# EAGLE design untitled (EAGLE 9.1.3)

## Sheet 1 of 2
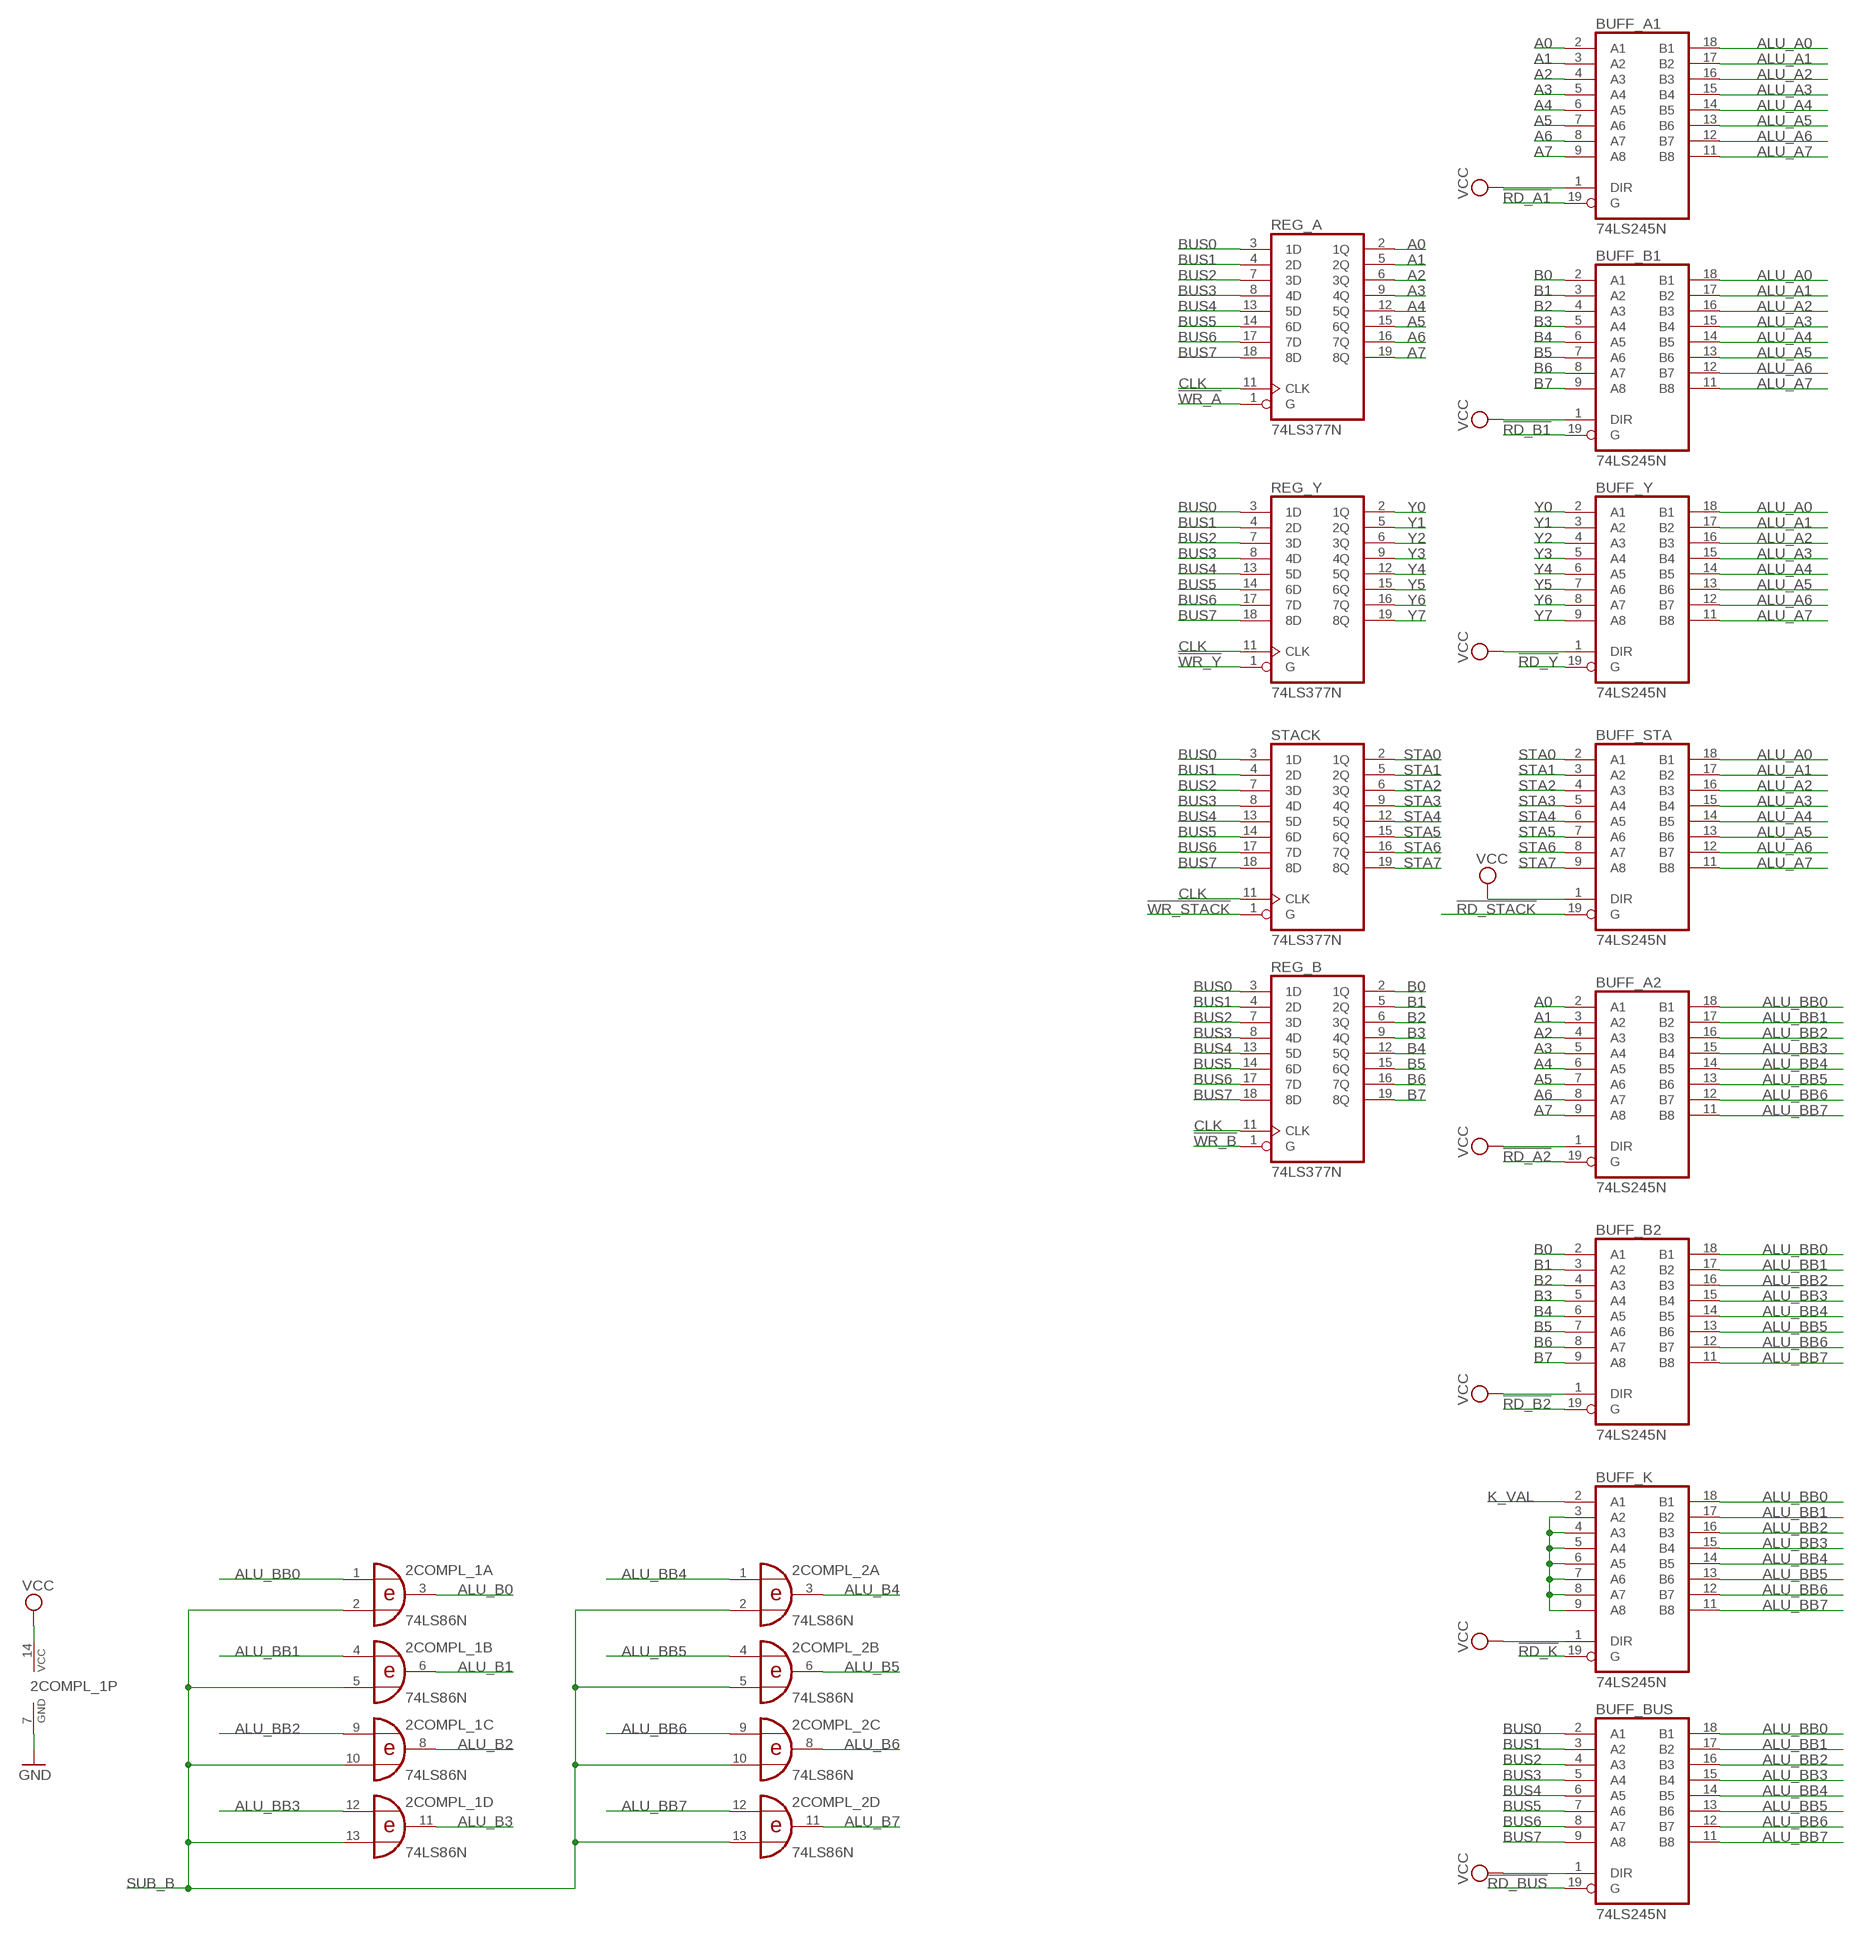
[diagram p0: schematic, sheet 1, part 1 of 2]
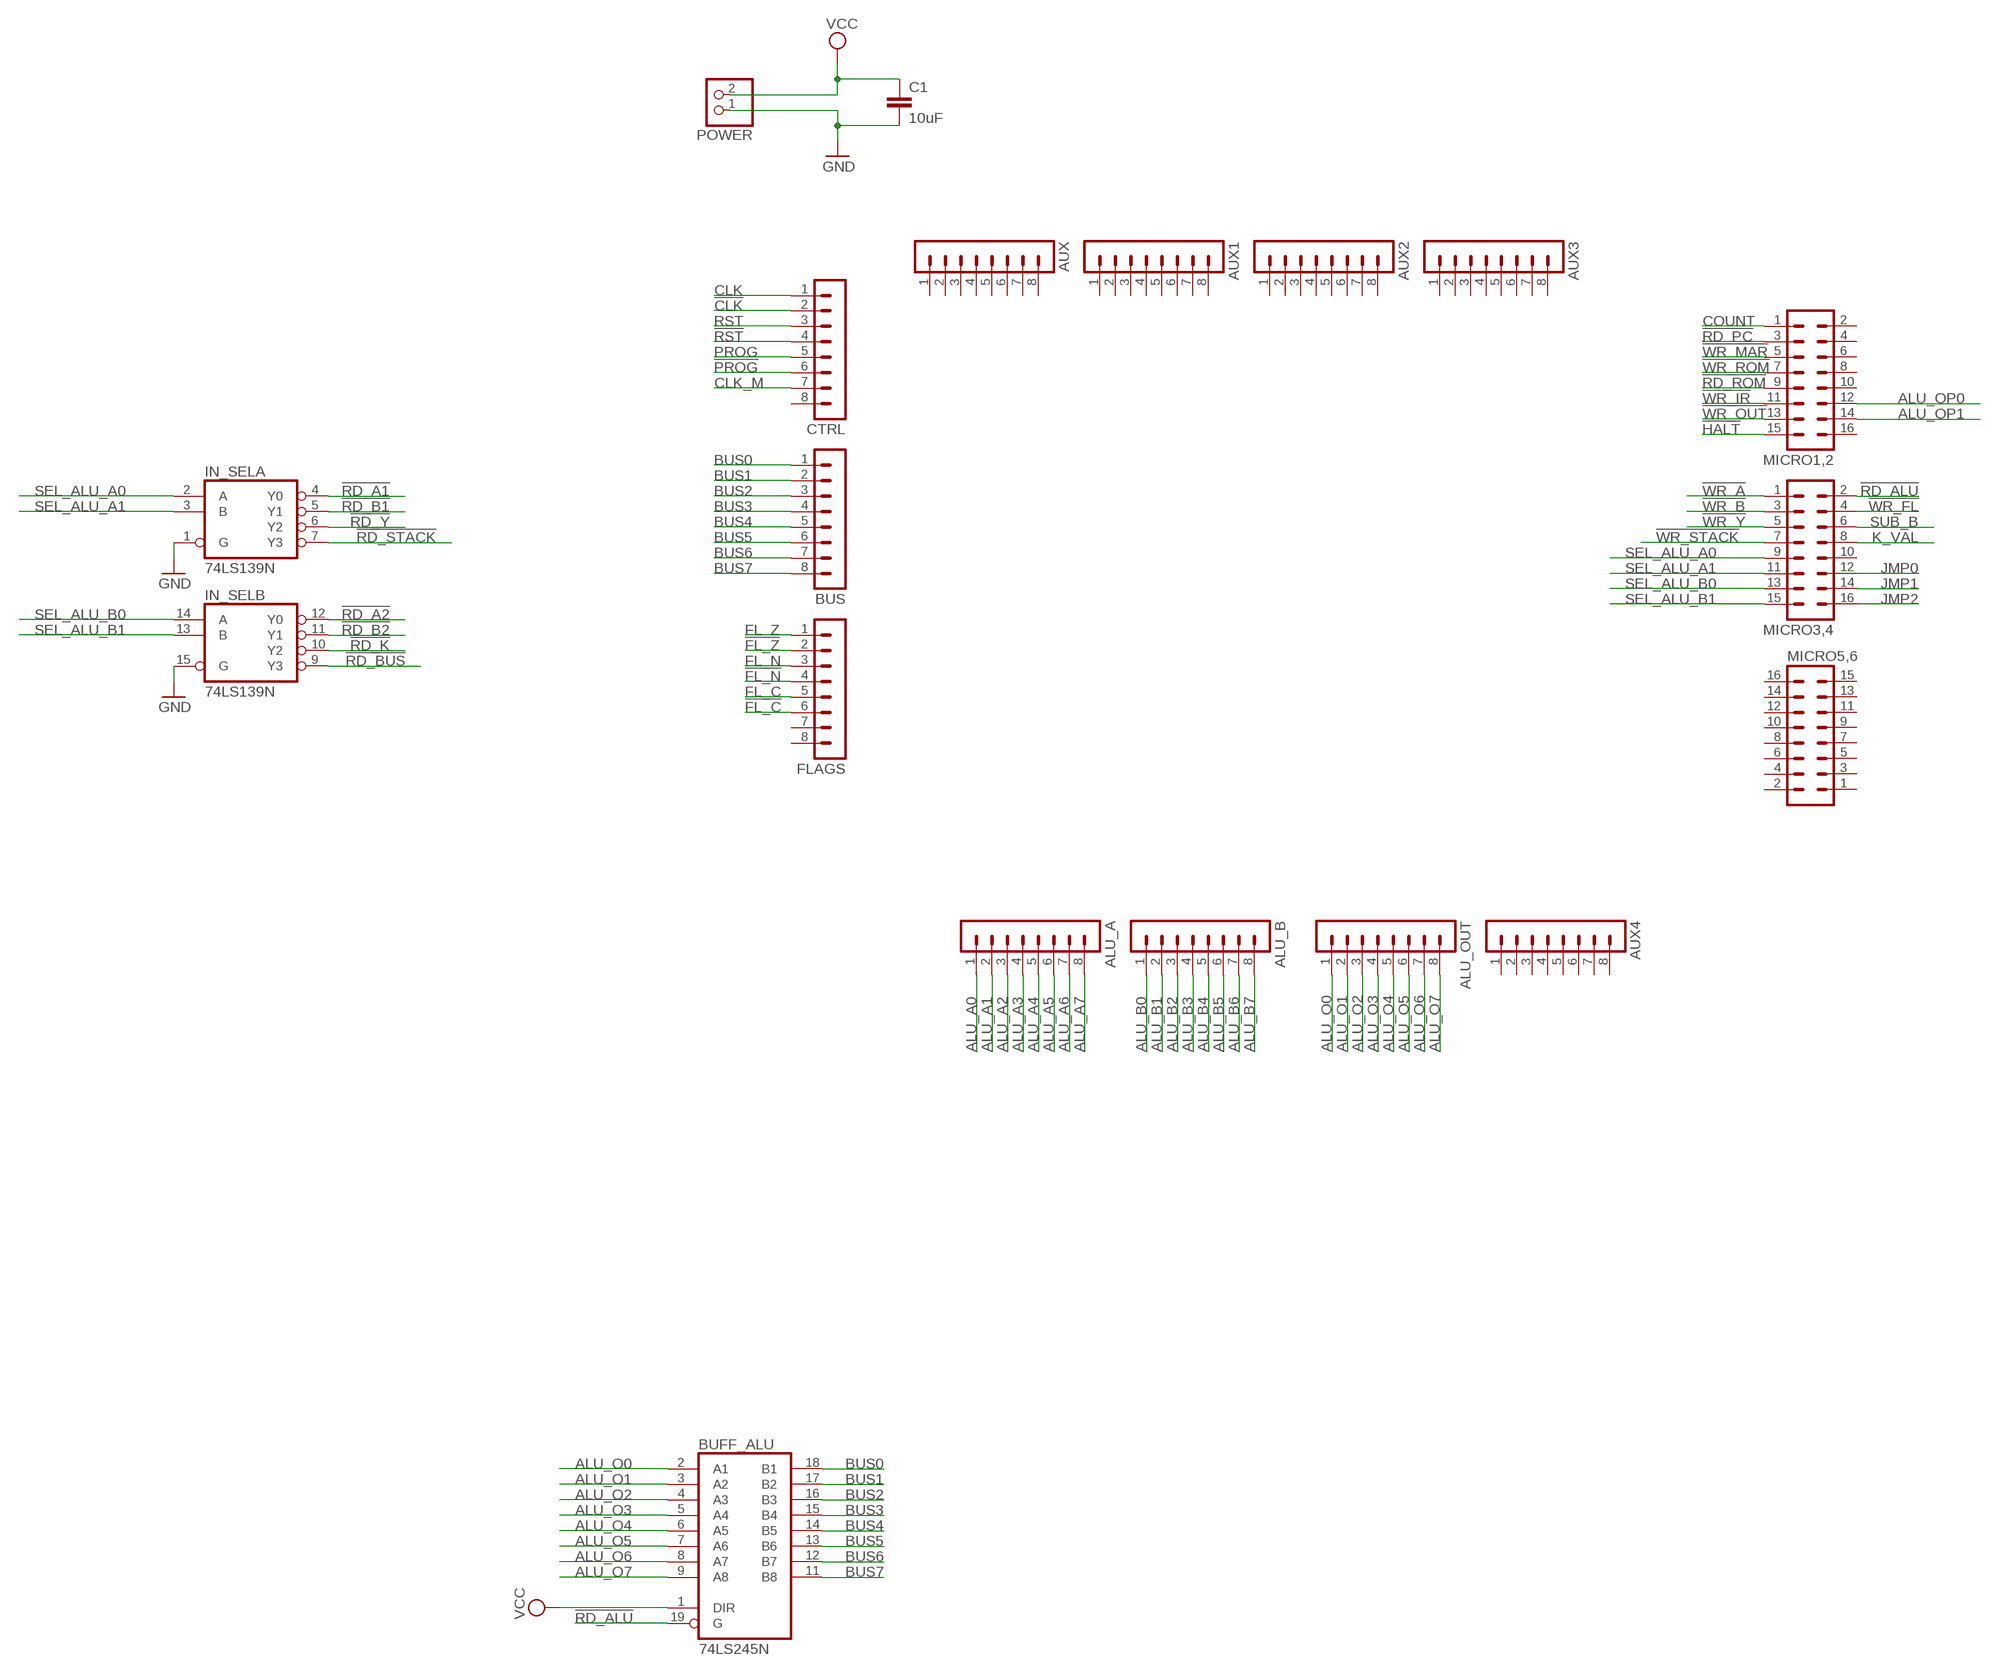
[diagram p1: schematic, sheet 1, part 2 of 2]

### Parts
2COMPL_1  74LS86N  [DIL14]
2COMPL_2  74LS86N  [DIL14]
ALU_A  MA08-1  [MA08-1]
ALU_B  MA08-1  [MA08-1]
ALU_OUT  MA08-1  [MA08-1]
AUX  MA08-1  [MA08-1]
AUX1  MA08-1  [MA08-1]
AUX2  MA08-1  [MA08-1]
AUX3  MA08-1  [MA08-1]
AUX4  MA08-1  [MA08-1]
BUFF_A1  74LS245N  [DIL20]
BUFF_A2  74LS245N  [DIL20]
BUFF_ALU  74LS245N  [DIL20]
BUFF_B1  74LS245N  [DIL20]
BUFF_B2  74LS245N  [DIL20]
BUFF_BUS  74LS245N  [DIL20]
BUFF_K  74LS245N  [DIL20]
BUFF_STA  74LS245N  [DIL20]
BUFF_Y  74LS245N  [DIL20]
BUS  MA08-1  [MA08-1]
C1  10uF  C-EU025-050X050  [C025-050X050]
CTRL  MA08-1  [MA08-1]
FLAGS  MA08-1  [MA08-1]
IN_SEL  74LS139N  [DIL16]
MICRO1,2  MA08-2  [MA08-2]
MICRO3,4  MA08-2  [MA08-2]
MICRO5,6  MA08-2  [MA08-2]
POWER  PINHD-1X2  [1X02]
REG_A  74LS377N  [DIL20]
REG_B  74LS377N  [DIL20]
REG_Y  74LS377N  [DIL20]
STACK  74LS377N  [DIL20]

### Nets
!CLK: CTRL.2
!FL_C: FLAGS.6
!FL_N: FLAGS.4
!FL_Z: FLAGS.2
!HALT: MICRO1,2.15
!PROG: CTRL.6
!RD_A1: BUFF_A1.19(G) IN_SEL.4(A:Y0)
!RD_A2: BUFF_A2.19(G) IN_SEL.12(B:Y0)
!RD_ALU: BUFF_ALU.19(G) MICRO3,4.2
!RD_B1: BUFF_B1.19(G) IN_SEL.5(A:Y1)
!RD_B2: BUFF_B2.19(G) IN_SEL.11(B:Y1)
!RD_BUS: BUFF_BUS.19(G) IN_SEL.9(B:Y3)
!RD_K: BUFF_K.19(G) IN_SEL.10(B:Y2)
!RD_PC: MICRO1,2.3
!RD_ROM: MICRO1,2.9
!RD_STACK: BUFF_STA.19(G) IN_SEL.7(A:Y3)
!RD_Y: BUFF_Y.19(G) IN_SEL.6(A:Y2)
!RST: CTRL.4
!WR_A: MICRO3,4.1 REG_A.1(G)
!WR_B: MICRO3,4.3 REG_B.1(G)
!WR_FL: MICRO3,4.4
!WR_IR: MICRO1,2.11
!WR_MAR: MICRO1,2.5
!WR_OUT: MICRO1,2.13
!WR_ROM: MICRO1,2.7
!WR_STACK: MICRO3,4.7 STACK.1(G)
!WR_Y: MICRO3,4.5 REG_Y.1(G)
A0: BUFF_A1.2(A1) BUFF_A2.2(A1) REG_A.2(1Q)
A1: BUFF_A1.3(A2) BUFF_A2.3(A2) REG_A.5(2Q)
A2: BUFF_A1.4(A3) BUFF_A2.4(A3) REG_A.6(3Q)
A3: BUFF_A1.5(A4) BUFF_A2.5(A4) REG_A.9(4Q)
A4: BUFF_A1.6(A5) BUFF_A2.6(A5) REG_A.12(5Q)
A5: BUFF_A1.7(A6) BUFF_A2.7(A6) REG_A.15(6Q)
A6: BUFF_A1.8(A7) BUFF_A2.8(A7) REG_A.16(7Q)
A7: BUFF_A1.9(A8) BUFF_A2.9(A8) REG_A.19(8Q)
ALU_A0: ALU_A.1 BUFF_A1.18(B1) BUFF_B1.18(B1) BUFF_STA.18(B1) BUFF_Y.18(B1)
ALU_A1: ALU_A.2 BUFF_A1.17(B2) BUFF_B1.17(B2) BUFF_STA.17(B2) BUFF_Y.17(B2)
ALU_A2: ALU_A.3 BUFF_A1.16(B3) BUFF_B1.16(B3) BUFF_STA.16(B3) BUFF_Y.16(B3)
ALU_A3: ALU_A.4 BUFF_A1.15(B4) BUFF_B1.15(B4) BUFF_STA.15(B4) BUFF_Y.15(B4)
ALU_A4: ALU_A.5 BUFF_A1.14(B5) BUFF_B1.14(B5) BUFF_STA.14(B5) BUFF_Y.14(B5)
ALU_A5: ALU_A.6 BUFF_A1.13(B6) BUFF_B1.13(B6) BUFF_STA.13(B6) BUFF_Y.13(B6)
ALU_A6: ALU_A.7 BUFF_A1.12(B7) BUFF_B1.12(B7) BUFF_STA.12(B7) BUFF_Y.12(B7)
ALU_A7: ALU_A.8 BUFF_A1.11(B8) BUFF_B1.11(B8) BUFF_STA.11(B8) BUFF_Y.11(B8)
ALU_B0: 2COMPL_1.3(A:O) ALU_B.1
ALU_B1: 2COMPL_1.6(B:O) ALU_B.2
ALU_B2: 2COMPL_1.8(C:O) ALU_B.3
ALU_B3: 2COMPL_1.11(D:O) ALU_B.4
ALU_B4: 2COMPL_2.3(A:O) ALU_B.5
ALU_B5: 2COMPL_2.6(B:O) ALU_B.6
ALU_B6: 2COMPL_2.8(C:O) ALU_B.7
ALU_B7: 2COMPL_2.11(D:O) ALU_B.8
ALU_BB0: 2COMPL_1.1(A:I0) BUFF_A2.18(B1) BUFF_B2.18(B1) BUFF_BUS.18(B1) BUFF_K.18(B1)
ALU_BB1: 2COMPL_1.4(B:I0) BUFF_A2.17(B2) BUFF_B2.17(B2) BUFF_BUS.17(B2) BUFF_K.17(B2)
ALU_BB2: 2COMPL_1.9(C:I0) BUFF_A2.16(B3) BUFF_B2.16(B3) BUFF_BUS.16(B3) BUFF_K.16(B3)
ALU_BB3: 2COMPL_1.12(D:I0) BUFF_A2.15(B4) BUFF_B2.15(B4) BUFF_BUS.15(B4) BUFF_K.15(B4)
ALU_BB4: 2COMPL_2.1(A:I0) BUFF_A2.14(B5) BUFF_B2.14(B5) BUFF_BUS.14(B5) BUFF_K.14(B5)
ALU_BB5: 2COMPL_2.4(B:I0) BUFF_A2.13(B6) BUFF_B2.13(B6) BUFF_BUS.13(B6) BUFF_K.13(B6)
ALU_BB6: 2COMPL_2.9(C:I0) BUFF_A2.12(B7) BUFF_B2.12(B7) BUFF_BUS.12(B7) BUFF_K.12(B7)
ALU_BB7: 2COMPL_2.12(D:I0) BUFF_A2.11(B8) BUFF_B2.11(B8) BUFF_BUS.11(B8) BUFF_K.11(B8)
ALU_O0: ALU_OUT.1 BUFF_ALU.2(A1)
ALU_O1: ALU_OUT.2 BUFF_ALU.3(A2)
ALU_O2: ALU_OUT.3 BUFF_ALU.4(A3)
ALU_O3: ALU_OUT.4 BUFF_ALU.5(A4)
ALU_O4: ALU_OUT.5 BUFF_ALU.6(A5)
ALU_O5: ALU_OUT.6 BUFF_ALU.7(A6)
ALU_O6: ALU_OUT.7 BUFF_ALU.8(A7)
ALU_O7: ALU_OUT.8 BUFF_ALU.9(A8)
ALU_OP0: MICRO1,2.12
ALU_OP1: MICRO1,2.14
B0: BUFF_B1.2(A1) BUFF_B2.2(A1) REG_B.2(1Q)
B1: BUFF_B1.3(A2) BUFF_B2.3(A2) REG_B.5(2Q)
B2: BUFF_B1.4(A3) BUFF_B2.4(A3) REG_B.6(3Q)
B3: BUFF_B1.5(A4) BUFF_B2.5(A4) REG_B.9(4Q)
B4: BUFF_B1.6(A5) BUFF_B2.6(A5) REG_B.12(5Q)
B5: BUFF_B1.7(A6) BUFF_B2.7(A6) REG_B.15(6Q)
B6: BUFF_B1.8(A7) BUFF_B2.8(A7) REG_B.16(7Q)
B7: BUFF_B1.9(A8) BUFF_B2.9(A8) REG_B.19(8Q)
BUS0: BUFF_ALU.18(B1) BUFF_BUS.2(A1) BUS.1 REG_A.3(1D) REG_B.3(1D) REG_Y.3(1D) STACK.3(1D)
BUS1: BUFF_ALU.17(B2) BUFF_BUS.3(A2) BUS.2 REG_A.4(2D) REG_B.4(2D) REG_Y.4(2D) STACK.4(2D)
BUS2: BUFF_ALU.16(B3) BUFF_BUS.4(A3) BUS.3 REG_A.7(3D) REG_B.7(3D) REG_Y.7(3D) STACK.7(3D)
BUS3: BUFF_ALU.15(B4) BUFF_BUS.5(A4) BUS.4 REG_A.8(4D) REG_B.8(4D) REG_Y.8(4D) STACK.8(4D)
BUS4: BUFF_ALU.14(B5) BUFF_BUS.6(A5) BUS.5 REG_A.13(5D) REG_B.13(5D) REG_Y.13(5D) STACK.13(5D)
BUS5: BUFF_ALU.13(B6) BUFF_BUS.7(A6) BUS.6 REG_A.14(6D) REG_B.14(6D) REG_Y.14(6D) STACK.14(6D)
BUS6: BUFF_ALU.12(B7) BUFF_BUS.8(A7) BUS.7 REG_A.17(7D) REG_B.17(7D) REG_Y.17(7D) STACK.17(7D)
BUS7: BUFF_ALU.11(B8) BUFF_BUS.9(A8) BUS.8 REG_A.18(8D) REG_B.18(8D) REG_Y.18(8D) STACK.18(8D)
CLK: CTRL.1 REG_A.11(CLK) REG_B.11(CLK) REG_Y.11(CLK) STACK.11(CLK)
CLK_M: CTRL.7
COUNT: MICRO1,2.1
FL_C: FLAGS.5
FL_N: FLAGS.3
FL_Z: FLAGS.1
GND: 2COMPL_1.7(P:GND) C1.2 IN_SEL.1(A:G) IN_SEL.15(B:G) POWER.1
JMP0: MICRO3,4.12
JMP1: MICRO3,4.14
JMP2: MICRO3,4.16
K_VAL: BUFF_K.2(A1) MICRO3,4.8
N$1: BUFF_K.3(A2) BUFF_K.4(A3) BUFF_K.5(A4) BUFF_K.6(A5) BUFF_K.7(A6) BUFF_K.8(A7) BUFF_K.9(A8)
PROG: CTRL.5
RST: CTRL.3
SEL_ALU_A0: IN_SEL.2(A:A) MICRO3,4.9
SEL_ALU_A1: IN_SEL.3(A:B) MICRO3,4.11
SEL_ALU_B0: IN_SEL.14(B:A) MICRO3,4.13
SEL_ALU_B1: IN_SEL.13(B:B) MICRO3,4.15
STA0: BUFF_STA.2(A1) STACK.2(1Q)
STA1: BUFF_STA.3(A2) STACK.5(2Q)
STA2: BUFF_STA.4(A3) STACK.6(3Q)
STA3: BUFF_STA.5(A4) STACK.9(4Q)
STA4: BUFF_STA.6(A5) STACK.12(5Q)
STA5: BUFF_STA.7(A6) STACK.15(6Q)
STA6: BUFF_STA.8(A7) STACK.16(7Q)
STA7: BUFF_STA.9(A8) STACK.19(8Q)
SUB_B: 2COMPL_1.2(A:I1) 2COMPL_1.5(B:I1) 2COMPL_1.10(C:I1) 2COMPL_1.13(D:I1) 2COMPL_2.2(A:I1) 2COMPL_2.5(B:I1) 2COMPL_2.10(C:I1) 2COMPL_2.13(D:I1) MICRO3,4.6
VCC: 2COMPL_1.14(P:VCC) BUFF_A1.1(DIR) BUFF_A2.1(DIR) BUFF_ALU.1(DIR) BUFF_B1.1(DIR) BUFF_B2.1(DIR) BUFF_BUS.1(DIR) BUFF_K.1(DIR) BUFF_STA.1(DIR) BUFF_Y.1(DIR) C1.1 POWER.2
Y0: BUFF_Y.2(A1) REG_Y.2(1Q)
Y1: BUFF_Y.3(A2) REG_Y.5(2Q)
Y2: BUFF_Y.4(A3) REG_Y.6(3Q)
Y3: BUFF_Y.5(A4) REG_Y.9(4Q)
Y4: BUFF_Y.6(A5) REG_Y.12(5Q)
Y5: BUFF_Y.7(A6) REG_Y.15(6Q)
Y6: BUFF_Y.8(A7) REG_Y.16(7Q)
Y7: BUFF_Y.9(A8) REG_Y.19(8Q)
Unconnected: AUX1.1 AUX1.2 AUX1.3 AUX1.4 AUX1.5 AUX1.6 AUX1.7 AUX1.8 AUX2.1 AUX2.2 AUX2.3 AUX2.4 AUX2.5 AUX2.6 AUX2.7 AUX2.8 AUX3.1 AUX3.2 AUX3.3 AUX3.4 AUX3.5 AUX3.6 AUX3.7 AUX3.8 AUX4.1 AUX4.2 AUX4.3 AUX4.4 AUX4.5 AUX4.6 AUX4.7 AUX4.8 AUX.1 AUX.2 AUX.3 AUX.4 AUX.5 AUX.6 AUX.7 AUX.8 CTRL.8 FLAGS.7 FLAGS.8 MICRO1,2.2 MICRO1,2.4 MICRO1,2.6 MICRO1,2.8 MICRO1,2.10 MICRO1,2.16 MICRO3,4.10 MICRO5,6.1 MICRO5,6.2 MICRO5,6.3 MICRO5,6.4 MICRO5,6.5 MICRO5,6.6 MICRO5,6.7 MICRO5,6.8 MICRO5,6.9 MICRO5,6.10 MICRO5,6.11 MICRO5,6.12 MICRO5,6.13 MICRO5,6.14 MICRO5,6.15 MICRO5,6.16

## Sheet 2 of 2

## Power pins joined to a net without a drawn wire
GND: 2COMPL_2.7(P:GND) BUFF_A1.10(GND) BUFF_A2.10(GND) BUFF_ALU.10(GND) BUFF_B1.10(GND) BUFF_B2.10(GND) BUFF_BUS.10(GND) BUFF_K.10(GND) BUFF_STA.10(GND) BUFF_Y.10(GND) IN_SEL.8(P:GND) REG_A.10(GND) REG_B.10(GND) REG_Y.10(GND) STACK.10(GND)
VCC: 2COMPL_2.14(P:VCC) BUFF_A1.20(VCC) BUFF_A2.20(VCC) BUFF_ALU.20(VCC) BUFF_B1.20(VCC) BUFF_B2.20(VCC) BUFF_BUS.20(VCC) BUFF_K.20(VCC) BUFF_STA.20(VCC) BUFF_Y.20(VCC) IN_SEL.16(P:VCC) REG_A.20(VCC) REG_B.20(VCC) REG_Y.20(VCC) STACK.20(VCC)

## Library data of the parts
2COMPL_1 2COMPL_2 = 74xx-eu:74*86: Quad 2-input EXCLUSIVE-OR (XOR) gate
ALU_A ALU_B ALU_OUT AUX AUX1-AUX4 BUS CTRL FLAGS = con-lstb:MA08-1: PIN HEADER; OC_FARNELL: unknown; OC_NEWARK: unknown
BUFF_A1 BUFF_A2 BUFF_ALU BUFF_B1 BUFF_B2 BUFF_BUS BUFF_K BUFF_STA BUFF_Y = 74xx-eu:74*245: Octal BUS TRANSCEIVER, 3-state
C1 = rcl:C-EU: CAPACITOR, European symbol; SPICEPREFIX: C
IN_SEL = 74xx-eu:74*139: Dual 2-line to 4-line DECODER/DEMULTIPLEXER
MICRO1,2 MICRO3,4 MICRO5,6 = con-lstb:MA08-2: PIN HEADER; OC_FARNELL: unknown; OC_NEWARK: unknown
POWER = pinhead:PINHD-1X2: PIN HEADER
REG_A REG_B REG_Y STACK = 74xx-eu:74*377: Octal D type FLIP FLOP, enable

## Board
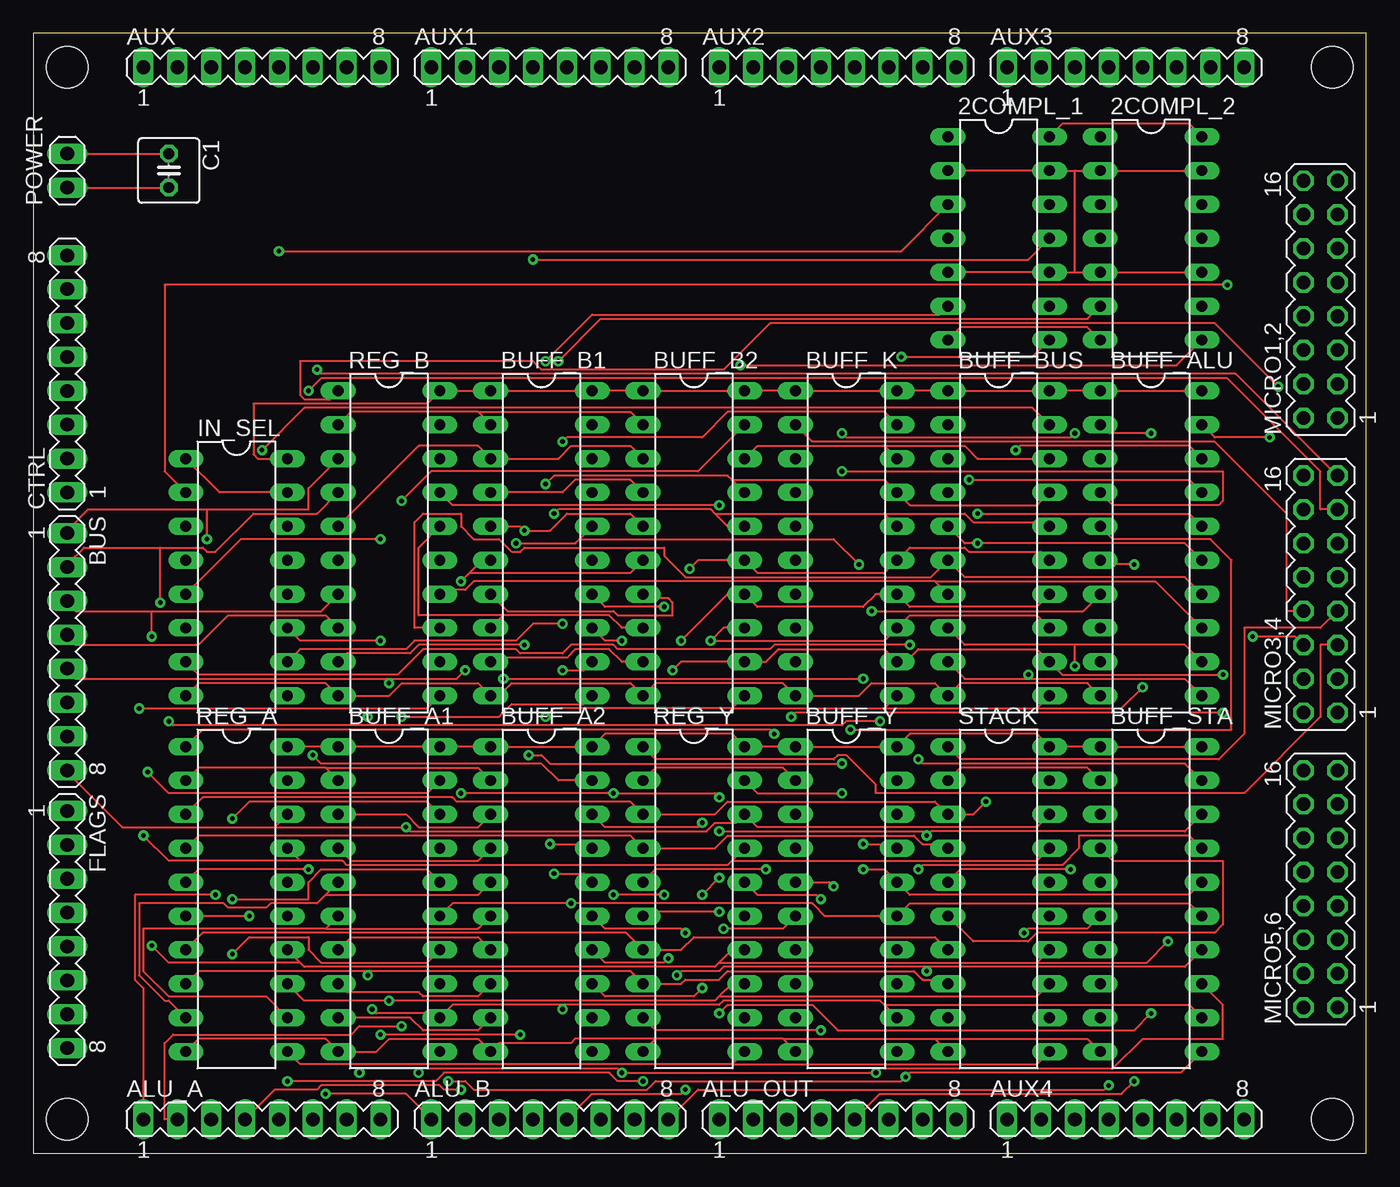
[diagram p2: board, top side]
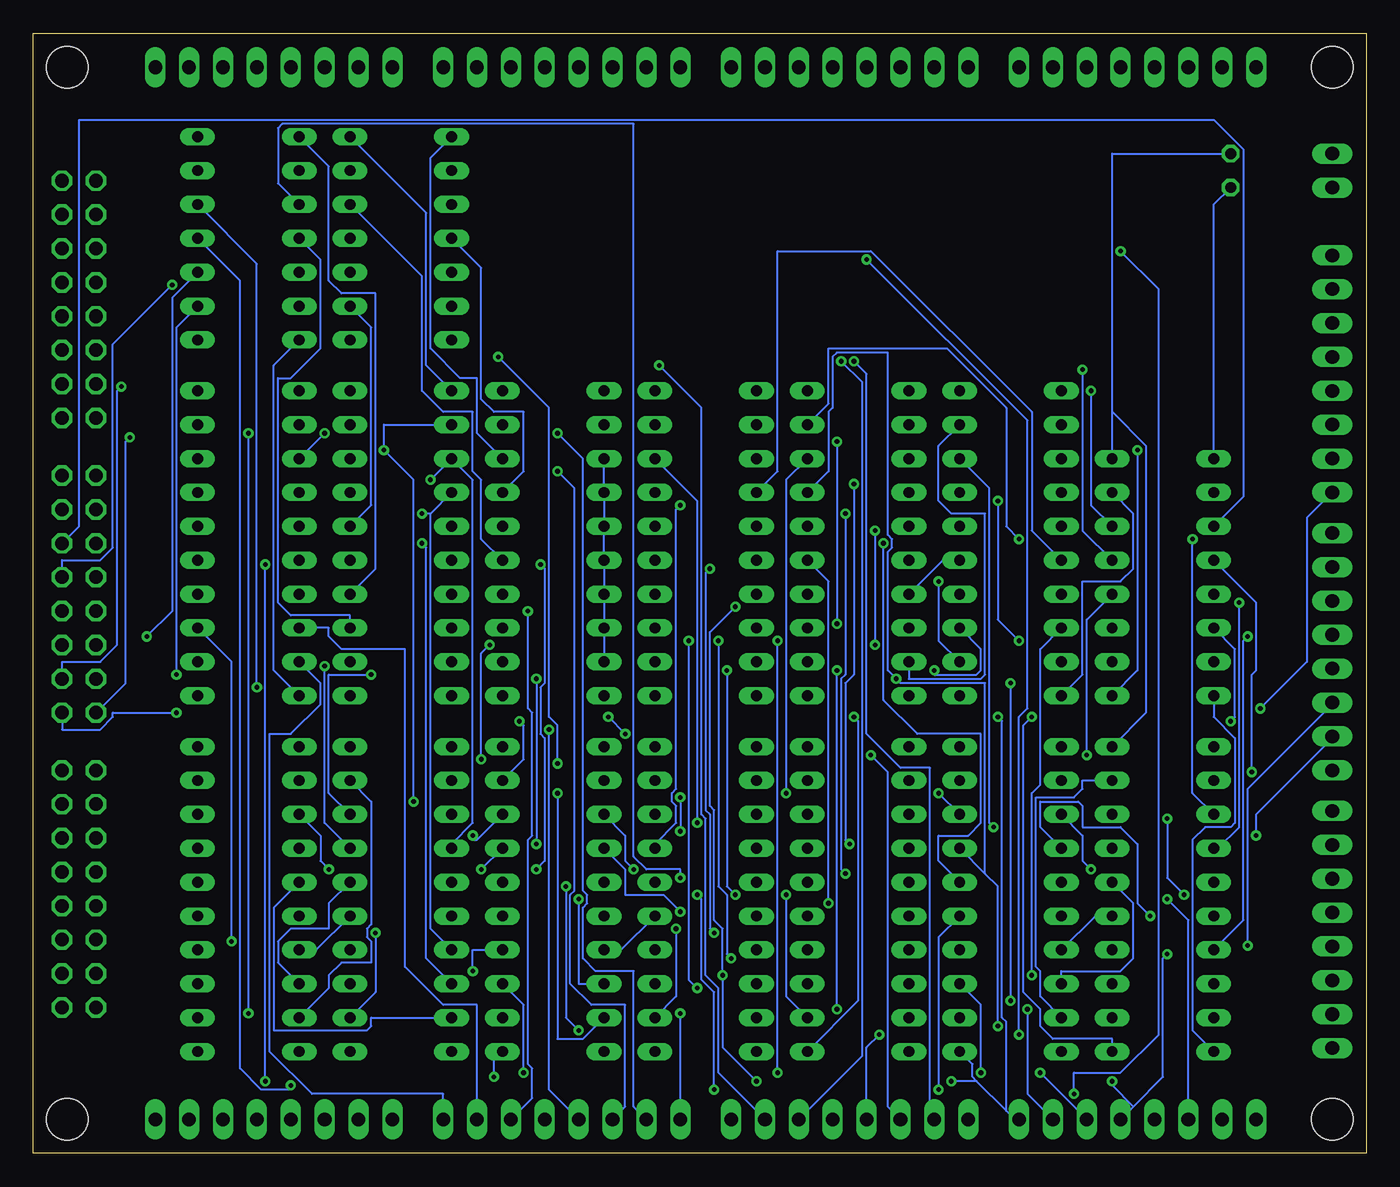
[diagram p3: board, bottom side, seen from below]

Size 99.95 x 83.95 mm. Coordinates in mm from the lower left corner, seen from the top.
Outline: 0,0 99.95,0 99.95,83.95 0,83.95 0,0
Copper layers (1*16): Top 0.035mm / dielectric 1.5mm / Bottom 0.035mm
Design rules "default": minimum track width 6mil, minimum drill 0.35mm, track to track 6mil, track to pad 6mil, pad to pad 6mil, via to via 6mil, smd to smd 6mil, copper to edge 40mil, drill to drill 6mil, minimum pad ring 10mil, minimum via ring 8mil, stop-mask expansion 4mil, vias tented up to drill 0mil, thermal gap 10mil
Holes 3.1 mm at 2.54,81.41 97.41,81.41 2.54,2.54 97.41,2.54

### Footprints (pad centres in the part's own frame; a part is rotated, then mirrored left to right if it is on the bottom)
DIL14 = drill 0.813 long: 1 -7.62,-3.81; 2 -5.08,-3.81; 3 -2.54,-3.81; 4 0,-3.81; 5 2.54,-3.81; 6 5.08,-3.81; 7 7.62,-3.81; 8 7.62,3.81; 9 5.08,3.81; 10 2.54,3.81; 11 0,3.81; 12 -2.54,3.81; 13 -5.08,3.81; 14 -7.62,3.81
MA08-1 = drill 1.016 long: 1 -8.89,0; 2 -6.35,0; 3 -3.81,0; 4 -1.27,0; 5 1.27,0; 6 3.81,0; 7 6.35,0; 8 8.89,0
DIL20 = drill 0.813 long: 1 -11.43,-3.81; 2 -8.89,-3.81; 3 -6.35,-3.81; 4 -3.81,-3.81; 5 -1.27,-3.81; 6 1.27,-3.81; 7 3.81,-3.81; 8 6.35,-3.81; 9 8.89,-3.81; 10 11.43,-3.81; 11 11.43,3.81; 12 8.89,3.81; 13 6.35,3.81; 14 3.81,3.81; 15 1.27,3.81; 16 -1.27,3.81; 17 -3.81,3.81; 18 -6.35,3.81; 19 -8.89,3.81; 20 -11.43,3.81
C025-050X050 = drill 0.813 octagon: 1 -1.27,0; 2 1.27,0
DIL16 = drill 0.813 long: 1 -8.89,-3.81; 2 -6.35,-3.81; 3 -3.81,-3.81; 4 -1.27,-3.81; 5 1.27,-3.81; 6 3.81,-3.81; 7 6.35,-3.81; 8 8.89,-3.81; 9 8.89,3.81; 10 6.35,3.81; 11 3.81,3.81; 12 1.27,3.81; 13 -1.27,3.81; 14 -3.81,3.81; 15 -6.35,3.81; 16 -8.89,3.81
MA08-2 = drill 1.016 octagon: 1 -8.89,-1.27; 2 -8.89,1.27; 3 -6.35,-1.27; 4 -6.35,1.27; 5 -3.81,-1.27; 6 -3.81,1.27; 7 -1.27,-1.27; 8 -1.27,1.27; 9 1.27,-1.27; 10 1.27,1.27; 11 3.81,-1.27; 12 3.81,1.27; 13 6.35,-1.27; 14 6.35,1.27; 15 8.89,-1.27; 16 8.89,1.27
1X02 = drill 1.016 long: 1 -1.27,0; 2 1.27,0

### Placement (x,y rotation side)
2COMPL_1  72.39,68.58 270 top
2COMPL_2  83.82,68.58 270 top
ALU_A  17.14,2.54 0 top
ALU_B  38.73,2.54 0 top
ALU_OUT  60.33,2.54 0 top
AUX  17.14,81.41 0 top
AUX1  38.73,81.41 0 top
AUX2  60.33,81.41 0 top
AUX3  81.92,81.41 0 top
AUX4  81.92,2.54 0 top
BUFF_A1  26.67,19.05 270 top
BUFF_A2  38.1,19.05 270 top
BUFF_ALU  83.82,45.72 270 top
BUFF_B1  38.1,45.72 270 top
BUFF_B2  49.53,45.72 270 top
BUFF_BUS  72.39,45.72 270 top
BUFF_K  60.96,45.72 270 top
BUFF_STA  83.82,19.05 270 top
BUFF_Y  60.96,19.05 270 top
BUS  2.54,37.59 270 top
C1  10.16,73.66 270 top
CTRL  2.54,58.42 90 top
FLAGS  2.54,16.76 270 top
IN_SEL  15.24,43.18 270 top
MICRO1,2  96.52,64.01 90 top
MICRO3,4  96.52,41.91 90 top
MICRO5,6  96.52,19.81 90 top
POWER  2.54,73.66 90 top
REG_A  15.24,19.05 270 top
REG_B  26.67,45.72 270 top
REG_Y  49.53,19.05 270 top
STACK  72.39,19.05 270 top

### Tracks (layer width: path | path; a pad name or v marks a point on that pad's centre or on a via)
!RD_A1  (via drill 0.35)
  Top 0.152: v8.57,28.57 10.16,26.99 29.53,26.99 BUFF_A1.19
  Bottom 0.152: IN_SEL.4 8.26,41.27 8.26,36.2 8.57,35.88 v8.57,28.57
!RD_A2  (via drill 0.35)
  Top 0.152: v20.95,29.84 21.59,29.21 38.1,29.21 39.37,27.94 BUFF_A2.19
  Bottom 0.152: IN_SEL.12 20.95,40.01 v20.95,29.84
!RD_ALU  (via drill 0.35)
  Top 0.152: BUFF_ALU.19 88.58,53.66 v92.71,53.66
  Bottom 0.152: v92.71,53.66 93.03,53.34 93.03,35.24 MICRO3,4.2
!RD_B1  (via drill 0.35)
  Top 0.152: IN_SEL.5 15.56,46.04 v26.04,46.04
  Bottom 0.152: v26.04,46.04 26.99,46.99 26.99,55.88 31.43,60.33 40.32,60.33 40.32,56.2 BUFF_B1.19
!RD_B2  (via drill 0.35)
  Top 0.152: IN_SEL.11 20,38.42 v26.04,38.42 | v27.62,48.9 29.84,51.12 49.85,51.12 BUFF_B2.19
  Bottom 0.152: v26.04,38.42 27.62,40.01 v27.62,48.9
!RD_BUS  (via drill 0.35)
  Top 0.152: v17.14,52.7 20.32,55.88 74.93,55.88 BUFF_BUS.19
  Bottom 0.152: IN_SEL.9 17.14,36.2 v17.14,52.7
!RD_K  (via drill 0.35)
  Top 0.152: IN_SEL.10 20,37.78 27.94,37.78 28.57,38.42 36.2,38.42 37.47,39.69 v39.69,39.69 | v39.69,53.34 40.01,53.66 50.16,53.66 52.07,55.56 63.82,55.56 BUFF_K.19
  Bottom 0.152: v39.69,53.34 v39.69,39.69
!RD_STACK  (via drill 0.35)
  Top 0.152: IN_SEL.7 12.38,35.88 27.3,35.88 29.21,37.78 36.2,37.78 36.51,37.47 39.69,37.47 40.32,38.1 43.5,38.1 43.81,37.78 55.24,37.78 55.56,38.1 v65.72,38.1 | v66.36,29.53 66.67,29.21 86.36,29.21 BUFF_STA.19
  Bottom 0.152: v65.72,38.1 66.36,37.47 v66.36,29.53
!RD_Y  (via drill 0.35)
  Top 0.152: v10.16,32.38 10.48,32.07 60.64,32.07 60.96,32.38 v63.5,32.38
  Bottom 0.152: IN_SEL.6 9.84,37.78 9.84,32.7 v10.16,32.38 | v63.5,32.38 63.18,32.07 63.18,29.53 BUFF_Y.19
!WR_A  (via drill 0.35)
  Top 0.152: REG_A.1 12.7,31.75 55.24,31.75 v55.56,31.43 | v56.83,32.7 57.15,33.02 v89.22,33.02
  Bottom 0.152: v56.83,32.7 v55.56,31.43 | v89.22,33.02 93.98,33.02 93.98,32.7 94.93,31.75 97.79,31.75 MICRO3,4.1
!WR_B  (via drill 0.35)
  Top 0.152: REG_B.1 22.23,56.52 20.32,56.52 20,56.83 20,59.37 37.47,59.37 38.1,58.74 51.75,58.74 55.24,62.23 88.58,62.23 v93.34,57.47
  Bottom 0.152: v93.34,57.47 93.66,57.15 93.66,38.1 94.93,36.83 97.79,36.83 MICRO3,4.3
!WR_STACK
  Top 0.152: STACK.1 69.53,29.53 88.9,29.53 90.81,31.43 90.81,39.37 96.52,39.37 MICRO3,4.7
!WR_Y
  Top 0.152: REG_Y.1 46.67,29.53 60.01,29.53 60.33,29.84 60.96,29.84 63.18,27.62 63.18,26.99 90.81,26.99 96.52,32.7 96.52,38.1 MICRO3,4.5
A0
  Top 0.152: REG_A.2 12.38,28.89 21.91,28.89 | BUFF_A1.2 21.91,28.89 | BUFF_A2.2 33.34,28.89 21.91,28.89
A1  (via drill 0.35)
  Top 0.152: REG_A.5 12.38,21.27 v20.64,21.27 | BUFF_A2.3 33.34,24.45 28.89,24.45 27.94,25.4 BUFF_A1.3
  Bottom 0.152: v20.64,21.27 21.27,21.91 21.27,23.81 BUFF_A1.3
A2  (via drill 0.35)
  Top 0.152: v16.19,17.78 REG_A.6 | BUFF_A2.4 33.34,21.91 23.81,21.91 BUFF_A1.4
  Bottom 0.152: v16.19,17.78 17.14,18.73 17.14,23.18 18.41,24.45 21.27,24.45 21.27,26.04 21.59,26.35 24.45,26.35 24.45,24.45 BUFF_A1.4
A3
  Top 0.152: REG_A.9 10.16,11.43 9.84,11.43 7.94,13.34 7.94,18.73 14.29,18.73 14.61,18.41 17.46,18.41 17.78,18.73 21.27,18.73 21.91,19.37 | BUFF_A1.5 21.91,19.37 | BUFF_A2.5 33.34,19.37 21.91,19.37
A4
  Top 0.152: REG_A.12 17.46,11.75 10.16,11.75 8.26,13.65 8.26,16.83 21.91,16.83 | BUFF_A1.6 21.91,16.83 | BUFF_A2.6 33.34,16.83 21.91,16.83
A5
  Top 0.152: BUFF_A2.7 33.34,16.19 23.81,16.19 BUFF_A1.7
  Bottom 0.152: BUFF_A1.7 20.32,17.78 REG_A.15
A6
  Top 0.152: BUFF_A1.8 23.5,12.06 28.89,12.06 29.21,11.75 33.34,11.75 BUFF_A2.8
  Bottom 0.152: REG_A.16 17.46,18.73 17.46,14.61 18.41,13.65 22.86,13.65 BUFF_A1.8
A7
  Top 0.152: BUFF_A1.9 28.26,10.16 29.21,9.21 33.34,9.21 BUFF_A2.9
  Bottom 0.152: REG_A.19 21.27,27.94 21.27,27.3 21.91,26.67 24.77,26.67 24.77,13.97 24.45,13.65 24.45,11.75 BUFF_A1.9
ALU_A0  (via drill 0.35)
  Top 0.152: BUFF_STA.18 86.36,24.13 67.31,24.13 v66.99,23.81 66.67,24.13 v51.44,24.13 | v32.07,26.99 v43.5,26.99 51.12,26.99 v51.44,26.67 | ALU_A.1 8.26,12.38 7.62,13.02 7.62,19.37 v13.65,19.37 | v14.92,25.08 16.19,26.35 29.53,26.35 BUFF_A1.18
  Bottom 0.152: BUFF_Y.18 66.67,23.5 66.99,23.5 v66.99,23.81 | v32.07,26.99 BUFF_A1.18 | v43.5,26.99 43.5,50.48 BUFF_B1.18 | v13.65,19.37 14.92,20.64 v14.92,25.08 | v51.44,26.67 v51.44,24.13
ALU_A1  (via drill 0.35)
  Top 0.152: v66.36,21.27 66.67,21.59 77.15,21.59 78.42,22.86 78.42,23.81 86.68,23.81 BUFF_STA.17 | v27.62,9.53 24.45,9.53 23.81,8.89 10.48,8.89 9.84,8.26 9.84,2.54 ALU_A.2 | BUFF_Y.17 64.45,23.18 v62.23,23.18 | v35.24,35.56 v62.23,35.56
  Bottom 0.152: v66.36,21.27 BUFF_Y.17 | 28.57,20.95 27.62,20 v27.62,9.53 | 28.57,20.95 BUFF_A1.17 | BUFF_B1.17 40.32,51.12 40.32,55.56 40.01,55.88 40.01,59.69 39.69,60.01 35.88,60.01 35.88,46.35 35.56,46.04 35.56,45.4 35.88,45.09 35.88,36.2 v35.24,35.56 34.92,35.24 28.57,35.24 28.57,20.95 | v62.23,35.56 v62.23,23.18
ALU_A2  (via drill 0.35)
  Top 0.152: BUFF_STA.16 86.68,19.37 65.72,19.37 BUFF_Y.16 63.82,21.27 v62.23,21.27 | BUFF_A1.16 29.53,21.27 21.59,21.27 20.64,20.32 20.64,19.05 v14.92,19.05 | 40.96,46.04 40.64,45.72 v36.2,45.72 | 40.96,46.04 BUFF_B1.16 | v61.91,44.13 60.01,46.04 40.96,46.04
  Bottom 0.152: v14.92,19.05 13.34,17.46 ALU_A.3 | v36.2,45.72 36.2,33.97 33.66,31.43 28.89,31.43 28.89,24.77 29.84,23.81 32.07,23.81 32.07,21.91 BUFF_A1.16 | v62.23,21.27 61.59,21.91 61.59,31.11 61.91,31.43 61.91,34.92 61.59,35.24 61.59,43.81 v61.91,44.13
ALU_A3  (via drill 0.35)
  Top 0.152: BUFF_A1.15 31.43,18.73 v40.32,18.73 58.42,18.73 59.37,17.78 BUFF_Y.15 65.72,18.73 86.68,18.73 BUFF_STA.15 | ALU_A.4 18.1,4.76 21.27,4.76 21.59,5.08 30.48,5.08 30.8,4.76 v32.07,4.76
  Bottom 0.152: BUFF_B1.15 40.32,42.86 v40.32,18.73 | v32.07,4.76 32.07,16.19 BUFF_A1.15
ALU_A4  (via drill 0.35)
  Top 0.152: BUFF_A1.14 29.53,14.29 21.59,14.29 20.64,15.24 20.64,16.19 16.19,16.19 v14.92,14.92 | 67.31,13.97 v66.99,13.65 | 67.31,13.97 86.36,13.97 BUFF_STA.14 | BUFF_B1.14 42.86,40.96 v47.31,40.96 | v48.26,13.34 48.58,13.65 51.44,13.65 51.75,13.97 67.31,13.97 | v19.05,5.4 30.16,5.4 30.8,6.03 43.18,6.03 43.81,5.4 v45.72,5.4
  Bottom 0.152: v14.92,14.92 15.24,14.61 15.24,5.71 17.46,3.49 | ALU_A.5 17.46,3.49 | BUFF_Y.14 66.99,15.24 v66.99,13.65 | v47.31,40.96 49.21,39.05 49.21,26.04 48.9,25.72 48.9,17.46 48.26,16.83 v48.26,13.34 48.26,7.94 v45.72,5.4 | 17.46,3.49 19.05,5.08 v19.05,5.4
ALU_A5  (via drill 0.35)
  Top 0.152: 28.57,6.35 v28.89,6.03 | 28.57,6.35 24.77,6.35 v24.45,6.03 | BUFF_B1.13 42.86,38.42 v44.13,38.42 | 28.57,6.35 43.81,6.35 v44.13,6.03 v63.18,6.03 63.5,6.35 80.96,6.35 83.19,8.57 89.22,8.57 89.22,11.11 BUFF_STA.13
  Bottom 0.152: BUFF_A1.13 28.89,11.11 v28.89,6.03 | ALU_A.6 v24.45,6.03 | v44.13,6.03 v44.13,38.42 | BUFF_Y.13 63.18,11.11 v63.18,6.03
ALU_A6  (via drill 0.35)
  Top 0.152: 30.8,10.48 31.43,11.11 39.69,11.11 | 30.8,10.48 BUFF_A1.12 30.8,10.48 | 39.69,11.11 51.44,11.11 51.75,11.43 63.5,11.43 63.82,11.11 | BUFF_Y.12 63.82,11.11 | BUFF_STA.12 86.68,11.11 63.82,11.11 | BUFF_B1.12 41.27,36.2 v39.69,36.2 | 39.69,11.11 v39.69,10.79 | v25.4,10.79 25.72,10.48 30.8,10.48
  Bottom 0.152: v39.69,10.79 v39.69,36.2 | ALU_A.7 25.4,4.45 v25.4,10.79
ALU_A7  (via drill 0.35)
  Top 0.152: BUFF_STA.11 86.04,6.03 65.72,6.03 v65.41,5.71 65.09,5.4 46.67,5.4 46.04,4.76 33.02,4.76 32.38,5.4 v31.11,5.4 | BUFF_B1.11 41.27,33.66 35.88,33.66 34.92,32.7 v27.62,32.7
  Bottom 0.152: BUFF_Y.11 65.41,6.99 v65.41,5.71 | BUFF_A1.11 29.53,6.67 29.53,5.71 29.21,5.4 | 26.99,3.17 26.35,2.54 ALU_A.8 | 26.99,3.17 29.21,5.4 | v27.62,32.7 27.3,32.38 27.3,10.16 26.99,9.84 26.99,3.17 | 29.21,5.4 v31.11,5.4
ALU_B0  (via drill 0.35)
  Top 0.152: 2COMPL_1.3 65.09,67.63 v18.41,67.63 | v21.91,4.45 27.94,4.45 ALU_B.1
  Bottom 0.152: v18.41,67.63 15.56,64.77 15.56,8.89 18.41,6.03 21.91,6.03 v21.91,4.45
ALU_B1  (via drill 0.35)
  Top 0.152: 2COMPL_1.6 67.94,62.87 41.91,62.87 v38.42,59.37
  Bottom 0.152: v38.42,59.37 37.47,58.42 37.47,31.43 34.92,28.89 32.7,28.89 32.7,2.86 ALU_B.2
ALU_B2  (via drill 0.35)
  Top 0.152: 2COMPL_1.8 74.93,59.69 v65.09,59.69 | v60.64,29.21 38.73,29.21 38.1,29.84 v37.15,29.84
  Bottom 0.152: v65.09,59.69 61.28,55.88 61.28,32.7 60.64,32.07 v60.64,29.21 | v37.15,29.84 35.88,28.57 35.88,3.49 ALU_B.3
ALU_B3  (via drill 0.35)
  Top 0.152: 2COMPL_1.11 74.61,66.99 v37.47,66.99 | v36.51,8.89 v26.04,8.89
  Bottom 0.152: v37.47,66.99 25.4,54.93 25.4,33.34 26.04,32.7 v26.04,8.89 | v36.51,8.89 37.47,7.94 ALU_B.4
ALU_B4  (via drill 0.35)
  Top 0.152: v50.16,19.37 v51.44,20.64 | v48.9,4.76 48.58,4.45 41.91,4.45 ALU_B.5
  Bottom 0.152: 2COMPL_2.3 81.6,72.71 81.6,76.83 81.28,77.15 54.93,77.15 54.93,22.23 53.98,21.27 51.44,21.27 v51.44,20.64 | v50.16,19.37 49.85,19.05 49.85,13.02 48.9,12.06 v48.9,4.76
ALU_B5  (via drill 0.35)
  Top 0.152: 2COMPL_2.6 79.06,62.55 42.55,62.55 v39.37,59.37
  Bottom 0.152: v39.37,59.37 37.78,57.78 37.78,7.3 ALU_B.6
ALU_B6  (via drill 0.35)
  Top 0.152: 2COMPL_2.8 85.72,59.05 v53.02,59.05
  Bottom 0.152: v53.02,59.05 49.85,55.88 49.85,25.4 49.53,25.08 49.53,13.34 48.58,12.38 48.58,6.03 ALU_B.7
ALU_B7  (via drill 0.35)
  Top 0.152: v80.64,5.08 80.33,4.76 49.85,4.76 ALU_B.8
  Bottom 0.152: 2COMPL_2.11 84.45,65.41 84.45,6.35 82.87,4.76 80.64,4.76 v80.64,5.08
ALU_BB0  (via drill 0.35)
  Top 0.152: BUFF_A2.18 42.86,24.45 49.85,24.45 v50.16,24.77 | 63.82,53.02 BUFF_K.18 | 63.82,53.02 54.29,53.02 BUFF_B2.18 | BUFF_BUS.18 70.8,52.07 69.85,53.02 63.82,53.02
  Bottom 0.152: v50.16,24.77 50.16,48.9 BUFF_B2.18 | 2COMPL_1.1 70.17,74.61 70.17,60.33 67.94,58.1 66.67,58.1 66.67,53.98 BUFF_K.18
ALU_BB1  (via drill 0.35)
  Top 0.152: BUFF_A2.17 41.59,23.18 v38.73,23.18 | v38.42,50.16 39.05,50.8 52.07,50.8 52.39,50.48 | BUFF_B2.17 52.39,50.48 | 52.39,50.48 63.82,50.48 BUFF_K.17 65.72,48.58 75.25,48.58 BUFF_BUS.17
  Bottom 0.152: v38.73,23.18 39.05,23.5 39.05,35.24 38.42,35.88 v38.42,50.16 | 2COMPL_1.4 66.36,66.36 66.36,56.52 65.41,55.56 63.18,55.56 63.18,51.12 BUFF_K.17
ALU_BB2  (via drill 0.35)
  Top 0.152: BUFF_A2.16 41.27,20.95 v39.05,20.95 | v39.05,47.94 39.37,48.26 50.8,48.26 51.12,47.94 | 51.12,47.94 52.07,46.99 BUFF_B2.16 | 63.82,47.94 BUFF_K.16 | 51.12,47.94 63.82,47.94 | BUFF_BUS.16 75.88,47.31 70.48,47.31 69.85,47.94 63.82,47.94
  Bottom 0.152: v39.05,20.95 39.37,21.27 39.37,35.56 39.05,35.88 v39.05,47.94 | 2COMPL_1.9 74.61,61.91 74.61,48.58 BUFF_BUS.16
ALU_BB3  (via drill 0.35)
  Top 0.152: BUFF_A2.15 42.86,16.83 48.58,16.83 v48.9,16.51 | v49.21,43.81 49.85,44.45 BUFF_B2.15 54.29,43.5 63.82,43.5 BUFF_K.15 65.72,45.4 69.85,45.4 70.17,45.09 75.56,45.09 BUFF_BUS.15
  Bottom 0.152: v48.9,16.51 49.21,16.83 49.21,25.4 49.53,25.72 49.53,43.5 v49.21,43.81 | 2COMPL_1.12 70.8,65.72 70.8,57.15 69.22,55.56 66.99,55.56 66.99,51.12 66.36,50.48 66.36,46.04 BUFF_K.15
ALU_BB4  (via drill 0.35)
  Top 0.152: BUFF_A2.14 42.86,14.29 47.31,14.29 v47.62,14.61 | v48.58,38.42 52.07,41.91 BUFF_B2.14 54.29,40.96 62.23,40.96 63.18,41.91 BUFF_K.14 65.72,40.96 75.25,40.96 BUFF_BUS.14
  Bottom 0.152: v47.62,14.61 47.94,14.92 47.94,19.37 48.58,20 v48.58,38.42 | 2COMPL_2.1 77.79,73.98 77.79,65.41 76.83,64.45 74.3,64.45 74.3,43.81 BUFF_BUS.14
ALU_BB5  (via drill 0.35)
  Top 0.152: BUFF_A2.13 42.86,11.75 49.53,11.75 v50.16,12.38 | BUFF_B2.13 51.75,39.37 v50.8,38.42 63.82,38.42 BUFF_K.13 65.72,40.32 75.25,40.32 BUFF_BUS.13
  Bottom 0.152: v50.16,12.38 50.8,13.02 v50.8,38.42 | 2COMPL_2.4 78.42,66.99 78.42,60.33 80.64,58.1 81.6,58.1 81.6,41.27 80.64,40.32 76.2,40.32 BUFF_BUS.13
ALU_BB6  (via drill 0.35)
  Top 0.152: v47.31,19.37 v43.5,19.37 | v47.94,36.2 48.58,36.83 BUFF_B2.12 54.93,36.83 55.88,37.78 63.82,37.78 BUFF_K.12 65.41,36.83 66.36,37.78 75.25,37.78 BUFF_BUS.12 77.15,35.88 v89.22,35.88
  Bottom 0.152: BUFF_A2.12 43.5,11.75 v43.5,19.37 | v47.31,19.37 47.94,20 v47.94,36.2 | 2COMPL_2.9 89.22,61.91 v89.22,35.88
ALU_BB7  (via drill 0.35)
  Top 0.152: v38.42,32.7 39.05,33.34 52.39,33.34 | BUFF_B2.11 52.39,33.34 | 63.82,33.34 BUFF_K.11 | 52.39,33.34 63.82,33.34 | 75.25,33.34 BUFF_BUS.11 | 63.82,33.34 75.25,33.34 | v83.19,34.92 81.6,33.34 75.25,33.34
  Bottom 0.152: BUFF_A2.11 38.1,11.43 38.1,32.38 v38.42,32.7 | 2COMPL_2.12 83.19,66.67 v83.19,34.92
ALU_O0  (via drill 0.35)
  Top 0.152: BUFF_ALU.2 80.64,53.98 v83.82,53.98 | v83.82,10.48 82.55,9.21 60.33,9.21 58.42,11.11 52.07,11.11 v51.44,10.48
  Bottom 0.152: v83.82,10.48 v83.82,53.98 | ALU_OUT.1 v51.44,10.48
ALU_O1  (via drill 0.35)
  Top 0.152: v78.11,53.98 77.79,53.66 60.96,53.66 v60.64,53.98
  Bottom 0.152: v78.11,53.98 BUFF_ALU.3 | v60.64,53.98 58.74,52.07 58.74,19.68 58.42,19.37 58.42,18.73 58.74,18.41 58.74,14.61 57.78,13.65 54.93,13.65 54.93,3.49 ALU_OUT.2
ALU_O2  (via drill 0.35)
  Top 0.152: BUFF_ALU.4 80.96,48.58 88.9,48.58 89.22,48.9 89.22,51.12 v60.64,51.12
  Bottom 0.152: v60.64,51.12 59.37,49.85 59.37,19.68 59.69,19.37 59.69,12.7 58.1,11.11 55.56,11.11 55.56,3.49 ALU_OUT.3
ALU_O3  (via drill 0.35)
  Top 0.152: BUFF_ALU.5 80.96,46.04 88.27,46.04 89.85,44.45 89.85,31.75 v61.28,31.75
  Bottom 0.152: v61.28,31.75 61.28,4.76 ALU_OUT.4
ALU_O4  (via drill 0.35)
  Top 0.152: BUFF_ALU.6 80.33,44.13 v82.55,44.13 | v82.55,5.4 81.6,4.45 63.5,4.45 ALU_OUT.5
  Bottom 0.152: v82.55,5.4 v82.55,44.13
ALU_O5  (via drill 0.35)
  Top 0.152: BUFF_ALU.7 78.74,40.64 v62.87,40.64
  Bottom 0.152: v62.87,40.64 62.87,33.34 62.55,33.02 62.55,23.81 62.87,23.5 62.87,6.67 62.55,6.35 62.55,4.13 ALU_OUT.6
ALU_O6
  Bottom 0.152: BUFF_ALU.8 77.79,39.37 77.79,38.73 76.83,37.78 72.07,37.78 72.07,13.97 69.22,11.11 66.67,11.11 ALU_OUT.7
ALU_O7
  Bottom 0.152: BUFF_ALU.9 78.42,35.24 78.42,33.66 80.64,31.43 82.23,31.43 82.23,7.62 79.06,4.45 69.22,4.45 ALU_OUT.8
B0
  Top 0.152: REG_B.2 23.81,55.56 33.34,55.56 | BUFF_B1.2 33.34,55.56 | BUFF_B2.2 44.77,55.56 33.34,55.56
B1
  Top 0.152: REG_B.5 28.89,53.02 33.34,53.02 BUFF_B1.3 39.37,52.07 40.32,53.02 44.77,53.02 BUFF_B2.3
B2
  Top 0.152: BUFF_B1.4 39.69,49.53 40.64,50.48 44.77,50.48 BUFF_B2.4
  Bottom 0.152: REG_B.6 25.08,46.67 25.08,55.56 37.15,67.63 44.13,67.63 44.13,51.12 BUFF_B2.4
B3  (via drill 0.35)
  Top 0.152: REG_B.9 23.5,37.47 28.26,37.47 28.89,38.1 v36.83,38.1 | BUFF_B1.5 36.51,46.99 v36.83,46.67 38.73,46.67 40.01,47.94 44.77,47.94 BUFF_B2.5
  Bottom 0.152: v36.83,46.67 v36.83,38.1
B4  (via drill 0.35)
  Top 0.152: 32.7,43.5 33.66,44.45 BUFF_B1.6 | 32.7,43.5 v32.07,42.86 | BUFF_B2.6 44.77,43.5 32.7,43.5
  Bottom 0.152: REG_B.12 32.07,38.42 v32.07,42.86
B5
  Top 0.152: BUFF_B2.7 46.04,41.59 47.62,41.59 47.94,41.27 47.94,40.32 43.81,40.32 43.5,40.64 35.56,40.64 BUFF_B1.7
  Bottom 0.152: BUFF_B1.7 31.75,44.45 REG_B.15
B6
  Top 0.152: 35.24,40.32 BUFF_B1.8 | 35.24,40.32 43.18,40.32 44.13,39.37 BUFF_B2.8 | REG_B.16 28.89,45.4 28.89,40.32 35.24,40.32
B7
  Top 0.152: BUFF_B1.9 34.61,37.15 40.01,37.15 40.64,37.78 43.18,37.78 44.13,36.83 BUFF_B2.9
  Bottom 0.152: REG_B.19 32.07,53.02 32.07,48.9 31.11,47.94 28.57,47.94 28.57,35.88 28.89,35.56 34.29,35.56 BUFF_B1.9
BUS0  (via drill 0.35)
  Top 0.152: REG_B.3 20.64,49.85 20.64,48.26 13.02,48.26 | 13.02,48.26 4.13,48.26 2.54,46.67 BUS.1 | v73.66,52.7 73.98,53.02 86.68,53.02 BUFF_ALU.18 | REG_A.3 12.7,26.67 31.43,26.67 31.75,26.35 44.77,26.35 REG_Y.3 51.12,25.4 52.07,26.35 67.63,26.35 STACK.3 70.48,25.4 v71.44,26.35 | v13.02,46.04 13.02,48.26
  Bottom 0.152: BUFF_BUS.2 73.66,54.61 v73.66,52.7 71.44,50.48 v71.44,26.35 | v13.02,46.04 13.02,26.99 REG_A.3
BUS1  (via drill 0.35)
  Top 0.152: REG_B.4 21.27,47.94 16.51,47.94 13.65,45.09 13.02,45.09 12.7,45.4 9.53,45.4 | 9.53,45.4 3.81,45.4 2.54,44.13 BUS.2 | REG_A.4 12.38,23.81 44.77,23.81 REG_Y.4 51.12,22.86 52.07,23.81 66.04,23.81 66.67,23.18 68.26,23.18 STACK.4 | BUFF_ALU.17 86.68,50.48 v70.17,50.48 | v9.53,41.27 9.53,45.4
  Bottom 0.152: STACK.4 68.58,23.18 66.99,24.77 66.99,50.48 BUFF_BUS.3 v70.17,50.48 | v9.53,41.27 9.53,24.45 11.11,22.86 REG_A.4
BUS2  (via drill 0.35)
  Top 0.152: REG_B.7 21.59,40.64 8.89,40.64 | 8.89,40.64 3.17,40.64 2.54,41.27 BUS.3 | REG_A.7 12.7,16.51 44.45,16.51 REG_Y.7 48.58,15.24 49.53,16.19 67.63,16.19 STACK.7 | BUFF_ALU.16 86.68,47.94 v70.8,47.94 | v8.89,38.73 8.89,40.64
  Bottom 0.152: 70.17,47.94 BUFF_BUS.4 | 70.17,47.94 70.17,16.83 STACK.7 | 70.17,47.94 v70.8,47.94 | v8.89,38.73 9.21,38.42 9.21,17.46 REG_A.7
BUS3  (via drill 0.35)
  Top 0.152: BUFF_BUS.5 69.85,45.72 v70.8,45.72 86.36,45.72 BUFF_ALU.15 | REG_B.8 21.91,40.32 14.61,40.32 12.38,38.1 3.17,38.1 2.54,38.73 BUS.4 | REG_A.8 12.38,13.65 25.08,13.65 | 25.08,13.65 44.77,13.65 REG_Y.8 48.58,12.7 48.9,13.02 51.44,13.02 52.07,13.65 66.04,13.65 66.67,13.02 68.26,13.02 STACK.8 | 25.08,13.65 v25.08,13.34
  Bottom 0.152: REG_B.8 24.45,37.78 24.45,27.62 25.08,26.99 v25.08,13.34 | v70.8,45.72 70.48,45.4 70.48,14.61 STACK.8
BUS4  (via drill 0.35)
  Top 0.152: REG_A.13 20.32,11.43 v26.67,11.43 51.12,11.43 51.44,11.75 | 51.44,11.75 52.39,12.7 REG_Y.13 | STACK.13 75.25,11.75 51.44,11.75 | BUFF_ALU.14 86.36,43.18 69.85,43.18 BUFF_BUS.6 67.31,43.18 48.9,43.18 47.31,44.77 47.31,45.4 36.83,45.4 36.51,45.09 35.88,45.09 34.92,46.04 33.02,46.04 32.07,46.99 32.07,47.94 29.21,47.94 28.57,47.31 28.57,39.37 REG_B.13 | v32.38,36.2 31.75,35.56 26.67,35.56 | 26.67,35.56 3.17,35.56 2.54,36.2 BUS.5 | 26.67,35.56 v26.67,35.24
  Bottom 0.152: REG_B.13 28.89,37.78 28.89,36.2 29.21,35.88 32.38,35.88 v32.38,36.2 | v26.67,35.24 v26.67,11.43
BUS5  (via drill 0.35)
  Top 0.152: REG_B.14 30.8,42.23 32.38,42.23 33.02,42.86 67.63,42.86 | BUFF_BUS.7 67.63,42.86 | BUFF_ALU.13 84.14,42.86 67.63,42.86 | 20,14.29 20.32,13.97 51.12,13.97 51.44,14.29 | 20,14.29 REG_A.14 | 51.44,14.29 52.39,15.24 REG_Y.14 | 75.25,14.29 STACK.14 | 51.44,14.29 75.25,14.29 | v8.89,15.56 10.16,14.29 20,14.29 | v85.09,15.88 83.5,14.29 75.25,14.29
  Bottom 0.152: v8.89,15.56 8.89,27.3 2.54,33.66 BUS.6 | BUFF_ALU.13 85.09,36.83 v85.09,15.88
BUS6  (via drill 0.35)
  Top 0.152: BUFF_BUS.8 69.85,38.1 78.11,38.1 | 78.11,38.1 86.36,38.1 BUFF_ALU.12 | 20,21.91 REG_A.17 | 20,21.91 23.18,21.91 23.5,21.59 52.07,21.59 52.39,21.91 | REG_Y.17 52.39,21.91 | STACK.17 75.25,21.91 52.39,21.91 | REG_B.17 31.43,48.58 v51.44,48.58 | v8.26,23.81 10.16,21.91 20,21.91 | v78.11,36.51 78.11,38.1
  Bottom 0.152: v51.44,48.58 51.75,48.26 51.75,27.3 52.07,26.99 52.07,26.35 51.75,26.04 51.75,24.77 53.34,23.18 REG_Y.17 | v8.26,23.81 8.26,25.4 2.54,31.11 BUS.7 | v78.11,36.51 78.11,24.77 STACK.17
BUS7  (via drill 0.35)
  Top 0.152: BUFF_ALU.11 86.36,35.56 74.61,35.56 | 74.61,35.56 69.85,35.56 BUFF_BUS.9 | STACK.18 75.25,24.45 54.29,24.45 REG_Y.18 52.7,24.77 51.12,24.77 50.48,24.13 28.26,24.13 v27.94,24.45 18.1,24.45 | v74.61,35.88 74.61,35.56 | 18.1,24.45 REG_A.18 | 18.1,24.45 6.67,24.45 2.54,28.57 BUS.8
  Bottom 0.152: v74.61,35.88 77.79,35.88 77.79,26.99 STACK.18 | REG_B.18 28.26,49.85 28.26,24.77 v27.94,24.45
CLK  (via drill 0.35)
  Top 0.152: REG_B.11 29.53,33.34 25.08,33.34 | v7.94,33.34 25.08,33.34 | REG_A.11 20,6.67 52.39,6.67 | REG_Y.11 52.39,6.67 | STACK.11 75.25,6.67 52.39,6.67 | v25.08,32.7 25.08,33.34
  Bottom 0.152: v7.94,33.34 4.45,36.83 4.45,47.62 CTRL.1 | v25.08,32.7 25.72,32.07 25.72,12.06 24.45,10.79 24.45,9.53 23.5,8.57 19.05,8.57 REG_A.11
GND
  Top 0.152: REG_A.10 12.38,8.57 21.91,8.57 BUFF_A1.10 25.72,7.62 26.67,8.57 33.34,8.57 BUFF_A2.10 34.92,8.26 40.32,8.26 40.64,8.57 46.67,8.57 | 46.67,8.57 REG_Y.10 | 56.2,8.57 46.67,8.57 | BUFF_Y.10 56.2,8.57 | 67.63,8.57 STACK.10 | 56.2,8.57 67.63,8.57 | BUFF_STA.10 79.06,8.57 67.63,8.57 | POWER.1 C1.2 | IN_SEL.1 13.97,49.53 IN_SEL.15 | 2COMPL_1.7 69.53,61.91 79.06,61.91 2COMPL_2.7 | BUFF_ALU.10 79.06,35.24 69.53,35.24 BUFF_BUS.10 67.63,35.24 62.87,35.24 61.91,34.29 BUFF_K.10 56.2,35.24 46.67,35.24 BUFF_B2.10 44.77,35.24 35.88,35.24 34.92,34.29 BUFF_B1.10 33.34,35.24 27.62,35.24 26.67,34.29 REG_B.10 21.91,35.24 12.38,35.24 IN_SEL.8
  Bottom 0.152: C1.2 11.43,71.12 IN_SEL.1 | 2COMPL_2.7 81.92,59.05 81.92,36.2 BUFF_ALU.10 | IN_SEL.15 17.46,47.94 17.46,43.81 18.41,42.86 21.27,42.86 21.27,35.88 REG_B.10 | REG_A.10 13.02,9.21 13.02,23.5 12.06,24.45 10.16,24.45 9.84,24.77 9.84,31.11 11.43,32.7 IN_SEL.8
K_VAL
  Top 0.152: BUFF_K.2 58.42,53.34 88.58,53.34 93.98,47.94 93.98,40.64 MICRO3,4.8
N$1
  Bottom 0.152: BUFF_K.3 BUFF_K.4 BUFF_K.5 BUFF_K.6 BUFF_K.7 BUFF_K.8 BUFF_K.9
SEL_ALU_A0  (via drill 0.35)
  Top 0.152: IN_SEL.2 9.84,51.12 9.84,65.09 v89.53,65.09
  Bottom 0.152: v89.53,65.09 93.98,60.64 93.98,45.4 94.93,44.45 97.79,44.45 MICRO3,4.9
SEL_ALU_A1
  Bottom 0.152: IN_SEL.3 9.21,49.21 9.21,75.25 11.43,77.47 96.52,77.47 96.52,46.99 MICRO3,4.11
SEL_ALU_B0  (via drill 0.35)
  Top 0.152: v20.64,57.15 21.59,58.1 89.53,58.1 96.52,51.12 96.52,48.26 MICRO3,4.13
  Bottom 0.152: IN_SEL.14 20.64,48.58 v20.64,57.15
SEL_ALU_B1  (via drill 0.35)
  Top 0.152: v21.27,58.74 21.59,58.42 90.17,58.42 MICRO3,4.15
  Bottom 0.152: IN_SEL.13 21.27,46.67 v21.27,58.74
STA0
  Top 0.152: STACK.2 69.53,28.89 79.06,28.89 BUFF_STA.2
STA1  (via drill 0.35)
  Top 0.152: STACK.5 69.53,21.27 v77.79,21.27
  Bottom 0.152: v77.79,21.27 78.42,21.91 78.42,23.81 BUFF_STA.3
STA2
  Top 0.152: STACK.6 70.48,15.88 74.61,15.88 75.25,16.51 88.58,16.51 89.22,17.14 89.22,21.91 80.96,21.91 BUFF_STA.4
STA3
  Bottom 0.152: STACK.9 74.61,10.16 74.61,9.53 74.93,9.21 81.92,9.21 81.92,18.41 BUFF_STA.5
STA4  (via drill 0.35)
  Top 0.152: v74.3,16.51 74.61,16.83 79.06,16.83 BUFF_STA.6
  Bottom 0.152: STACK.12 74.3,12.06 v74.3,16.51
STA5
  Bottom 0.152: STACK.15 78.74,15.24 BUFF_STA.7
STA6
  Bottom 0.152: BUFF_STA.8 81.6,14.29 81.6,15.88 80.64,16.83 77.79,16.83 77.79,18.73 STACK.16
STA7
  Bottom 0.152: BUFF_STA.9 77.79,12.38 77.79,13.34 76.83,14.29 74.61,14.29 74.61,15.88 74.93,16.19 74.93,16.83 74.61,17.14 74.61,26.35 STACK.19
SUB_B  (via drill 0.35)
  Top 0.152: 2COMPL_1.2 2COMPL_1.13 78.11,73.66 | 78.11,73.66 2COMPL_2.2 2COMPL_2.13 | 2COMPL_1.5 2COMPL_1.10 78.11,66.04 | 78.11,66.04 2COMPL_2.5 2COMPL_2.10 | MICRO3,4.6 94.61,38.73 v91.44,38.73 | 78.11,66.04 78.11,73.66
  Bottom 0.152: v91.44,38.73 89.53,40.64 89.53,64.14 2COMPL_2.10
VCC
  Top 0.152: REG_A.20 BUFF_A1.1 BUFF_A1.20 BUFF_A2.1 BUFF_A2.20 42.86,31.43 52.39,31.43 REG_Y.20 BUFF_Y.1 BUFF_Y.20 65.72,31.43 75.25,31.43 STACK.20 BUFF_STA.1 BUFF_STA.20 | 2COMPL_1.14 77.15,77.15 86.68,77.15 2COMPL_2.14 | BUFF_ALU.20 BUFF_ALU.1 BUFF_BUS.20 BUFF_BUS.1 BUFF_K.20 BUFF_K.1 BUFF_B2.20 BUFF_B2.1 BUFF_B1.20 BUFF_B1.1 REG_B.20 29.53,56.2 16.51,56.2 16.51,52.39 16.83,52.07 IN_SEL.16 | POWER.2 C1.1
  Bottom 0.152: C1.1 19.05,74.93 19.05,55.56 | IN_SEL.16 19.05,55.56 | 2COMPL_1.14 70.48,70.48 70.48,59.05 BUFF_BUS.1 | REG_A.20 16.51,33.02 16.51,53.02 19.05,55.56
Y0
  Top 0.152: REG_Y.2 46.67,28.89 56.2,28.89 BUFF_Y.2
Y1  (via drill 0.35)
  Top 0.152: REG_Y.5 46.67,21.27 v54.93,21.27
  Bottom 0.152: v54.93,21.27 55.56,21.91 55.56,23.81 BUFF_Y.3
Y2  (via drill 0.35)
  Top 0.152: REG_Y.6 46.04,18.1 v51.44,18.1
  Bottom 0.152: v51.44,18.1 52.7,19.37 55.56,19.37 55.56,21.27 BUFF_Y.4
Y3  (via drill 0.35)
  Top 0.152: REG_Y.9 46.67,9.21 v59.05,9.21 | v60.01,20 59.69,20.32 BUFF_Y.5
  Bottom 0.152: v59.05,9.21 60.01,10.16 v60.01,20
Y4  (via drill 0.35)
  Top 0.152: v51.75,16.83 56.2,16.83 BUFF_Y.6
  Bottom 0.152: REG_Y.12 51.75,11.75 v51.75,16.83
Y5
  Bottom 0.152: REG_Y.15 55.88,15.24 BUFF_Y.7
Y6  (via drill 0.35)
  Top 0.152: v59.05,19.05 58.74,19.37 54.29,19.37 REG_Y.16
  Bottom 0.152: BUFF_Y.8 59.05,12.7 v59.05,19.05
Y7  (via drill 0.35)
  Top 0.152: v60.64,26.99 54.29,26.99 REG_Y.19
  Bottom 0.152: BUFF_Y.9 58.74,8.57 60.64,8.57 v60.64,26.99